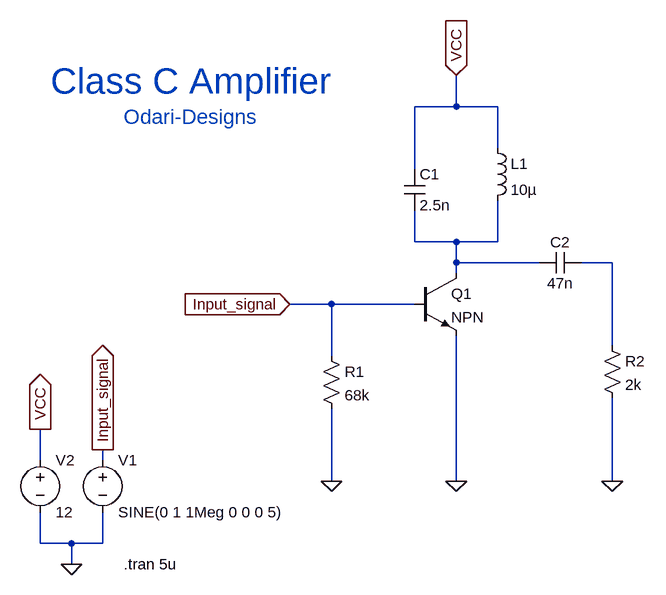
[diagram p0: schematic ClassCAmp.asc]
ClassCAmp.asc, the LTspice schematic file:
Version 4.1
SHEET 1 1000 680
WIRE 640 -384 640 -432
WIRE 640 -384 576 -384
WIRE 704 -384 640 -384
WIRE 704 -320 704 -384
WIRE 576 -288 576 -384
WIRE 576 -176 576 -224
WIRE 640 -176 576 -176
WIRE 704 -176 704 -240
WIRE 704 -176 640 -176
WIRE 640 -144 640 -176
WIRE 768 -144 640 -144
WIRE 880 -144 832 -144
WIRE 640 -128 640 -144
WIRE 448 -80 384 -80
WIRE 576 -80 448 -80
WIRE 880 -16 880 -144
WIRE 448 0 448 -80
WIRE 0 160 0 112
WIRE 96 160 96 144
WIRE 448 192 448 80
WIRE 640 192 640 -32
WIRE 880 192 880 64
WIRE 0 288 0 240
WIRE 48 288 0 288
WIRE 96 288 96 240
WIRE 96 288 48 288
WIRE 48 320 48 288
FLAG 48 320 0
FLAG 0 112 VCC
IOPIN 0 112 Out
FLAG 96 144 Input_signal
IOPIN 96 144 Out
FLAG 384 -80 Input_signal
IOPIN 384 -80 In
FLAG 640 -432 VCC
IOPIN 640 -432 In
FLAG 448 192 0
FLAG 640 192 0
FLAG 880 192 0
SYMBOL voltage 96 144 R0
WINDOW 123 0 0 Left 0
WINDOW 39 0 0 Left 0
SYMATTR InstName V1
SYMATTR Value SINE(0 1 1Meg 0 0 0 5)
SYMBOL voltage 0 144 R0
WINDOW 123 0 0 Left 0
WINDOW 39 0 0 Left 0
SYMATTR InstName V2
SYMATTR Value 12
SYMBOL npn 576 -128 R0
SYMATTR InstName Q1
SYMBOL res 432 -16 R0
SYMATTR InstName R1
SYMATTR Value 68k
SYMBOL ind 688 -336 R0
SYMATTR InstName L1
SYMATTR Value 10µ
SYMATTR SpiceLine Rser=1m
SYMBOL cap 560 -288 R0
SYMATTR InstName C1
SYMATTR Value 2.5n
SYMBOL res 864 -32 R0
SYMATTR InstName R2
SYMATTR Value 2k
SYMBOL cap 832 -160 R90
WINDOW 0 0 32 VBottom 2
WINDOW 3 32 32 VTop 2
SYMATTR InstName C2
SYMATTR Value 47n
TEXT 128 320 Left 2 !.tran 5u
TEXT 16 -424 Left 5 ;Class C Amplifier
TEXT 128 -368 Left 3 ;Odari-Designs

The netlist it stands for:
* ClassCAmp.asc
V1 Input_signal 0 SINE(0 1 1Meg 0 0 0 5)
V2 VCC 0 12
Q1 N001 Input_signal 0 0 NPN
R1 Input_signal 0 68k
L1 VCC N001 10µ Rser=1m
C1 VCC N001 2.5n
R2 N002 0 2k
C2 N002 N001 47n
.model NPN NPN
.model PNP PNP
.lib standard.bjt
.tran 5u
* Class C Amplifier
* Odari-Designs
.backanno
.end